# Altium schematic sheet Gas_Sampler-5V_Buck.SchDoc: 5V Buck
size Tabloid; Organization: Sensible Robotics LLC; Address1: 120 E Church Ave Suite B; Address2: Ridgecrest CA, 93555; Revision: 0; SheetNumber: 4; SheetTotal: 12; ApprovedBy: Approved Name; Engineer: Mike Licitra; PageSetup: Record=PageOptions|CenterHorizontal=True|CenterVertical=True|PrintScale=0.98|XCorrection=1.00|YCorrection=1.00|PrintKind=0|BorderSize=5000000|LeftOffset=0|BottomOffset=0|Orientation=2|PaperLength=1000|PaperWidth=1000|Scale=100|PaperSource=15|PrintQuality=600|MediaType=1|DitherType=10|PaperKind=Tabloid|PrintScaleMode=1
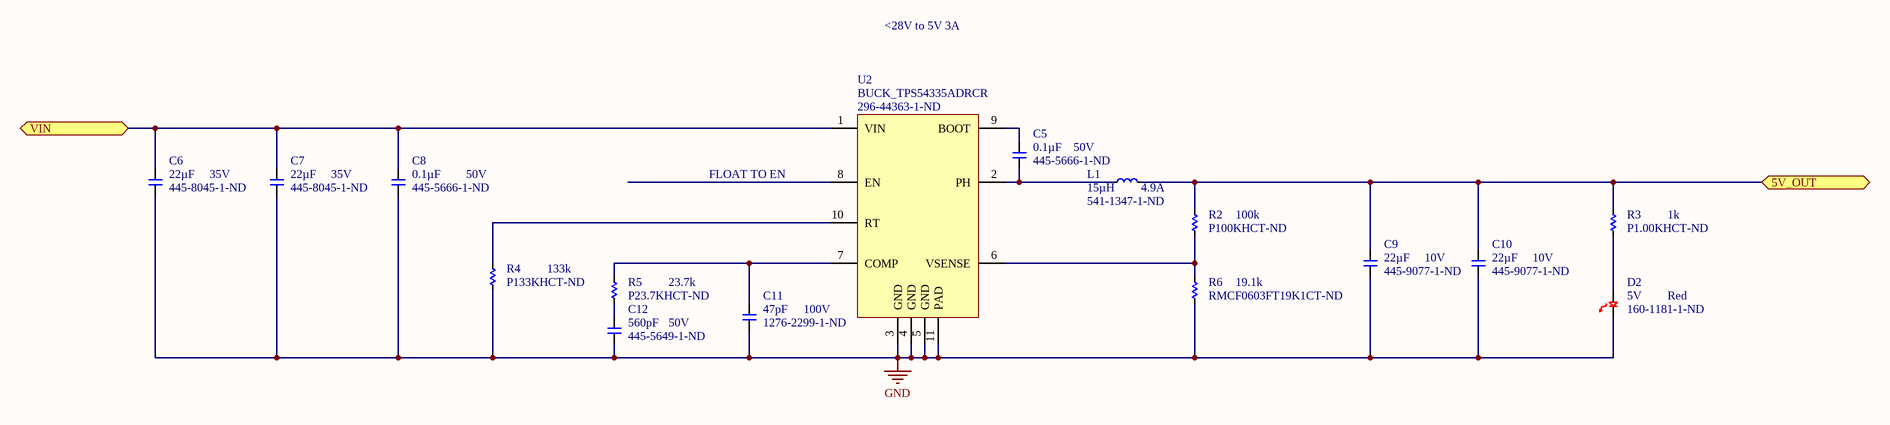
[diagram p0: Gas_Sampler-5V_Buck.SchDoc]

## Parts
C5  value 0.1µF  Voltage - Rated: 50V  Supplier Part Number 1: 445-5666-1-ND  [C0603]  (hidden comment: CAP_CER_0603_0.1UF_50V_10%_X7R)
C6  value 22µF  Voltage - Rated: 35V  Supplier Part Number 1: 445-8045-1-ND  [C1206]  (hidden comment: CAP_CER_1206_22UF_35V_20%_X5R)
C7  value 22µF  Voltage - Rated: 35V  Supplier Part Number 1: 445-8045-1-ND  [C1206]  (hidden comment: CAP_CER_1206_22UF_35V_20%_X5R)
C8  value 0.1µF  Voltage - Rated: 50V  Supplier Part Number 1: 445-5666-1-ND  [C0603]  (hidden comment: CAP_CER_0603_0.1UF_50V_10%_X7R)
C9  value 22µF  Supplier Part Number 1: 445-9077-1-ND  Voltage - Rated: 10V  [C0603]  (hidden comment: CAP_CER_0603_22UF_10V_20%_X5R)
C10  value 22µF  Supplier Part Number 1: 445-9077-1-ND  Voltage - Rated: 10V  [C0603]  (hidden comment: CAP_CER_0603_22UF_10V_20%_X5R)
C11  value 47pF  Voltage - Rated: 100V  Supplier Part Number 1: 1276-2299-1-ND  [C0603]  (hidden comment: CAP_CER_0603_47PF_100V_5%_NP0)
C12  value 560pF  Supplier Part Number 1: 445-5649-1-ND  Voltage - Rated: 50V  [C0603]  (hidden comment: CAP_CER_0603_560PF_50V_5%_NP0)
D2  5V  Supplier Part Number 1: 160-1181-1-ND  Color: Red  [LED_0603_RED]
L1  value 15µH  Current Rating: 4.9A  Supplier Part Number 1: 541-1347-1-ND  [INDUCTOR_IHLP3232_4MM_HEIGHT]  (hidden comment: IND_15UH_4.9A_IHLP3232DZER150M11)
R2  value 100k  Supplier Part Number 1: P100KHCT-ND  [R0603]  (hidden comment: RES_0603_100K_OHM_1/10W_1%)
R3  value 1k  Supplier Part Number 1: P1.00KHCT-ND  [R0603]  (hidden comment: RES_0603_1K_OHM_1/10W_1%)
R4  value 133k  Supplier Part Number 1: P133KHCT-ND  [R0603]  (hidden comment: RES_0603_133K_OHM_1/10W_1%)
R5  value 23.7k  Supplier Part Number 1: P23.7KHCT-ND  [R0603]  (hidden comment: RES_0603_23.7K_OHMS_1/10W_1%)
R6  value 19.1k  Supplier Part Number 1: RMCF0603FT19K1CT-ND  [R0603]  (hidden comment: RES_0603_19.1K_OHM_1/10W_1%)
U2  BUCK_TPS54335ADRCR  Supplier Part Number 1: 296-44363-1-ND  [PVSON50P300X300X70-10N]

## Ports
5V_OUT, VIN

## Nets
GND: C6.2 C7.2 C8.2 C9.2 C10.2 C11.2 C12.2 D2.2(CATHODE) R4.1 R6.1 U2.3(GND) U2.4(GND) U2.5(GND) U2.11(PAD)
5V_OUT: C9.1 C10.1 L1.2 R2.2 R3.2 ; port 5V_OUT
VIN: C6.1 C7.1 C8.1 U2.1(VIN) ; port VIN
NetC5_1: C5.1 U2.9(BOOT)
NetC5_2: C5.2 L1.1 U2.2(PH)
NetC11_1: C11.1 R5.2 U2.7(COMP)
NetC12_1: C12.1 R5.1
NetD2_1: D2.1(ANODE) R3.1
NetR2_1: R2.1 R6.2 U2.6(VSENSE)
NetR4_2: R4.2 U2.10(RT)

Not connected (* = marked no-connect by the designer): U2 8(EN)

## Notes on the sheet
- <28V to 5V 3A
- FLOAT TO EN
- CONFIDENTIAL DOCUMENT
- DUPLICATION PROHIBITED
- ENGINEER
- PCB FAB #
- SCH #
- REV
- Sensible
- Robotics
- THIS DOCUMENT CONTAINS INFORMATION AND OR DATA, WHICH IS PROPRIETARY AND CONFIDENTIAL TO SENSIBLE ROBOTICS LLC.  THIS INFORMATION AND OR DATA, IS TO BE USED ONLY FOR THE BENEFIT OF THE SUPPLIER, AND IS NOT TO BE USED FOR THE BENEFIT OF OTHER PARTIES WITHOUT WRITTEN CONSENT.
- DATE
- PCB ASSY #
- SIZE
- Tabloid
- SHEET
- OF
- FILE

## Library data of the parts
C5 C8 = CAP_CER_0603_0.1UF_50V_10%_X7R: CAP CER 0.1UF 50V 10% X7R 0603; Manufacturer: TDK Corporation; Manufacturer Part Number: CGA3E2X7R1H104K080AA; Supplier 1: Digi-Key; RoHS: RoHS Compliant; Packaging: Cut Tape (CT); Tolerance: ±10%; Temperature Coefficient: X7R; Mounting Type: Surface Mount, MLCC; Operating Temperature: -55°C ~ 125°C; Applications: Automotive; Ratings: AEC-Q200; Package / Case: 0603 (1608 Metric); Size / Dimension: 0.063" L x 0.031" W (1.60mm x 0.80mm); Thickness (Max): 0.035" (0.90mm); ComponentLink1URL: http://product.tdk.com/capacitor/mlcc/en/documents/mlcc_automotive_general_en.pdf; ComponentLink1Description: http://product.tdk.com/capacitor/mlcc/en/documents/mlcc_automotive_general_en.pdf
C6 C7 = CAP_CER_1206_22UF_35V_20%_X5R: CAP CER 22UF 35V X5R 1206; Manufacturer: TDK Corporation; Manufacturer Part Number: C3216X5R1V226M160AC; Tolerance: ±20%; Supplier 1: Digi-Key; RoHS: RoHS Compliant; Packaging: Cut Tape (CT); Temperature Coefficient: X5R; Mounting Type: Surface Mount, MLCC; Operating Temperature: -55°C ~ 85°C; Applications: General Purpose; Package / Case: 1206 (3216 Metric); Size / Dimension: 0.126" L x 0.063" W (3.20mm x 1.60mm); Thickness (Max): 0.071" (1.80mm); Features: Low ESL; ComponentLink1URL: https://product.tdk.com/info/en/catalog/datasheets/mlcc_commercial_general_en.pdf; ComponentLink1Description: https://product.tdk.com/info/en/catalog/datasheets/mlcc_commercial_general_en.pdf
C9 C10 = CAP_CER_0603_22UF_10V_20%_X5R: CAP CER 22UF 10V 20% X5R 0603; Manufacturer: TDK Corporation; Manufacturer Part Number: C1608X5R1A226M080AC; Part Number: 150-00202-00; Supplier 1: Digi-Key; Temperature Coefficient: X5R; Tolerance: ±20%
C11 = CAP_CER_0603_47PF_100V_5%_NP0: CAP CER 47PF 100V C0G/NP0 0603; Manufacturer: Samsung Electro-Mechanics; Manufacturer Part Number: CL10C470JC8NNNC; Tolerance: ±5%; Temperature Coefficient: C0G, NP0; Supplier 1: Digi-Key; RoHS: RoHS Compliant; Packaging: Cut Tape (CT); Mounting Type: Surface Mount, MLCC; Operating Temperature: -55°C ~ 125°C; Applications: General Purpose; Package / Case: 0603 (1608 Metric); Size / Dimension: 0.063" L x 0.031" W (1.60mm x 0.80mm); Thickness (Max): 0.035" (0.90mm); ComponentLink1URL: http://www.samsungsem.com/kr/support/product-search/mlcc/CL10C470JC8NNNC.jsp; ComponentLink1Description: Datasheet
C12 = CAP_CER_0603_560PF_50V_5%_NP0: CAP CER 560PF 50V 5% NP0 0603; Manufacturer: TDK Corporation; Manufacturer Part Number: CGA3E2C0G1H561J080AA; Temperature Coefficient: C0G, NP0; Supplier 1: Digi-Key; RoHS: RoHS Compliant; Packaging: Cut Tape (CT); Tolerance: ±5%; Mounting Type: Surface Mount, MLCC; Operating Temperature: -55°C ~ 125°C; Applications: Automotive; Ratings: AEC-Q200; Package / Case: 0603 (1608 Metric); Size / Dimension: 0.063" L x 0.031" W (1.60mm x 0.80mm); Thickness (Max): 0.035" (0.90mm); ComponentLink1URL: http://product.tdk.com/capacitor/mlcc/en/documents/mlcc_automotive_general_en.pdf; ComponentLink1Description: http://product.tdk.com/capacitor/mlcc/en/documents/mlcc_automotive_general_en.pdf
D2 = LED_0603_RED_LR_LTST-C190CKT: LED RED CLEAR 0603 SMD; Manufacturer: Lite-On Inc; Millicandela Rating: 10mcd; Wavelength - Dominant: 638nm; Wavelength - Peak: 660nm; Viewing Angle: 130°; Lens Style/Size: Rectangle with Flat Top, 1.1mm x 0.8mm; Voltage - Forward (Vf) Typ: 1.8V; Current - Test: 10mA; Supplier 1: Digi-Key; Manufacturer Part Number: LTST-C190CKT; Lens Type: Clear; Package / Case: 0603 (1608 Metric); Size / Dimension: 1.60mm L x 0.80mm W; Height: 0.80mm; Mounting Type: Surface Mount; Packaging: Cut Tape (CT); ComponentLink1URL: http://media.digikey.com/pdf/Data%20Sheets/Lite-On%20PDFs/LTST-C190CKT.pdf; ComponentLink1Description: Datasheet
L1 = IND_15UH_4.9A_IHLP3232DZER150M11: INDUCTOR POWER 15UH 4.9A SMD; Manufacturer: Vishay Dale; Tolerance: ±20%; Current - Saturation: 3.7A; Shielding: Shielded; DC Resistance (DCR): 65.3 mOhm Max; Frequency - Test: 100kHz; Supplier 1: Digi-Key; Manufacturer Part Number: IHLP3232DZER150M11; RoHS: RoHS Compliant; Category: Inductors, Coils, Chokes; Packaging: Cut Tape (CT); Operating Temperature: -55°C ~ 125°C; Mounting Type: Surface Mount; Package / Case: Non Standard; Size / Dimension: 0.340" L x 0.322" W (8.64mm x 8.18mm); Height - Seated (Max): 0.158" (4.00mm); ComponentLink1URL: http://media.digikey.com/PDF/Data%20Sheets/Vishay%20Dale%20PDFs/IHLP-3232DZ-11.pdf; ComponentLink1Description: http://media.digikey.com/PDF/Data%20Sheets/Vishay%20Dale%20PDFs/IHLP-3232DZ-11.pdf
R2 = RES_0603_100K_OHM_1/10W_1%: RES 100K OHM 1/10W 1% 0603 SMD; Manufacturer: Panasonic Electronic Components; Manufacturer Part Number: ERJ-3EKF1003V; Part Number: 470-00120-00; Power (Watts): 0.1W, 1/10W; Temperature Coefficient: ±100ppm/°C; Supplier 1: Digi-Key; RoHS: RoHS Compliant; Category: Resistors; Stock 1: 8082554; Pricing 1: 1=0.1, 50=0.0138, 100=0.0105, 250=0.0078, 500=0.00576, 1000=0.00384 (USD); Packaging: Cut Tape (CT); Composition: Thick Film; Features: -; Tolerance: ±1%; Package / Case: 0603 (1608 Metric); Supplier Device Package: 0603; Size / Dimension: 0.063" L x 0.031" W (1.60mm x 0.80mm); Height: 0.022" (0.55mm); Number of Terminations: 2; ComponentLink1URL: http://industrial.panasonic.com/www-cgi/jvcr13pz.cgi?E+PZ+3+AOA0002+ERJ3EKF1003V+7+WW; ComponentLink1Description: http://industrial.panasonic.com/www-cgi/jvcr13pz.cgi?E+PZ+3+AOA0002+ERJ3EKF1003V+7+WW
R3 = RES_0603_1K_OHM_1/10W_1%: RES 1K OHM 1/10W 1% 0603 SMD; Manufacturer: Panasonic Electronic Components; Manufacturer Part Number: ERJ-3EKF1001V; Power (Watts): 0.1W, 1/10W; Temperature Coefficient: ±100ppm/°C; Supplier 1: Digi-Key; RoHS: RoHS Compliant; Packaging: Cut Tape (CT); Composition: Thick Film; Features: -; Tolerance: ±1%; Package / Case: 0603 (1608 Metric); Supplier Device Package: 0603; Size / Dimension: 0.063" L x 0.031" W (1.60mm x 0.80mm); Height: 0.022" (0.55mm); Number of Terminations: 2; ComponentLink1URL: http://industrial.panasonic.com/www-cgi/jvcr13pz.cgi?E+PZ+3+AOA0002+ERJ3EKF1001V+7+WW; ComponentLink1Description: http://industrial.panasonic.com/www-cgi/jvcr13pz.cgi?E+PZ+3+AOA0002+ERJ3EKF1001V+7+WW
R4 = RES_0603_133K_OHM_1/10W_1%: RES 133K OHM 1% 1/10W 0603; Manufacturer: Panasonic Electronic Components; Manufacturer Part Number: ERJ-3EKF1333V; Power (Watts): 0.1W, 1/10W; Temperature Coefficient: ±100ppm/°C; Supplier 1: Digi-Key; Packaging: Cut Tape (CT); Tolerance: ±1%; Composition: Thick Film; Features: Automotive AEC-Q200; Operating Temperature: -55°C ~ 155°C; Package / Case: 0603 (1608 Metric); Supplier Device Package: 0603; Height: 0.022" (0.55mm); Number of Terminations: 2; ComponentLink1URL: http://industrial.panasonic.com/www-cgi/jvcr13pz.cgi?E+PZ+3+AOA0002+ERJ3EKF1183V+7+WW; ComponentLink1Description: http://industrial.panasonic.com/www-cgi/jvcr13pz.cgi?E+PZ+3+AOA0002+ERJ3EKF1183V+7+WW
R5 = RES_0603_23.7K_OHMS_1/10W_1%: RES 23.7K OHM 1% 1/10W 0603; Manufacturer: Panasonic Electronic Components; Manufacturer Part Number: ERJ-3EKF2372V; Power (Watts): 0.1W, 1/10W; Temperature Coefficient: ±100ppm/°C; Supplier 1: Digi-Key; RoHS: RoHS Compliant; Category: Resistors; Stock 1: 58901; Pricing 1: 1=0.1, 10=0.063, 100=0.0257, 1000=0.01153, 2500=0.01001 (USD); Packaging: Cut Tape (CT); Part Status: Active; Tolerance: ±1%; Composition: Thick Film; Features: Automotive AEC-Q200; Operating Temperature: -55°C ~ 155°C; Package / Case: 0603 (1608 Metric); Supplier Device Package: 0603; Size / Dimension: 0.063" L x 0.032" W (1.60mm x 0.80mm); Height - Seated (Max): 0.022" (0.55mm); ComponentLink1URL: https://industrial.panasonic.com/cdbs/www-data/pdf/RDA0000/AOA0000C304.pdf; ComponentLink1Description: https://industrial.panasonic.com/cdbs/www-data/pdf/RDA0000/AOA0000C304.pdf
R6 = RES_0603_19.1K_OHM_1/10W_1%: RES 19.1K OHM 1% 1/10W 0603; Manufacturer: Stackpole Electronics Inc; Manufacturer Part Number: RMCF0603FT19K1; Power (Watts): 0.1W, 1/10W; Temperature Coefficient: ±100ppm/°C; Supplier 1: Digi-Key; Packaging: Cut Tape (CT); Tolerance: ±1%; Composition: Thick Film; Features: Moisture Resistant; Operating Temperature: -55°C ~ 155°C; Package / Case: 0603 (1608 Metric); Supplier Device Package: 0603; Height: 0.022" (0.55mm); Number of Terminations: 2; ComponentLink1URL: https://www.seielect.com/catalog/sei-rmcf_rmcp.pdf; ComponentLink1Description: https://www.seielect.com/catalog/sei-rmcf_rmcp.pdf
U2 = BUCK_TPS54335ADRCR: IC REG BUCK ADJUSTABLE 3A 10VSON; Manufacturer: Texas Instruments; Function: Step-Down; Output Configuration: Positive; Number of Outputs: 1; Voltage - Input (Min): 4.5V; Voltage - Input (Max): 28V; Voltage - Output (Min/Fixed): 0.8V; Voltage - Output (Max): 24V; Frequency - Switching: 50kHz ~ 1.5MHz; Synchronous Rectifier: Yes; Supplier 1: Digi-Key; Manufacturer Part Number: TPS54335ADRCR; Packaging: Cut Tape (CT); Topology: Buck; Output Type: Adjustable; Current - Output: 3A; Operating Temperature: -40°C ~ 85°C (TA); Mounting Type: Surface Mount; Package / Case: 10-VFDFN Exposed Pad; Supplier Device Package: 10-VSON (3x3); ComponentLink1URL: http://www.ti.com/general/docs/suppproductinfo.tsp?distId=10&gotoUrl=http%3A%2F%2Fwww.ti.com%2Flit%2Fgpn%2Ftps54335a; ComponentLink1Description: http://www.ti.com/general/docs/suppproductinfo.tsp?distId=10&gotoUrl=http%3A%2F%2Fwww.ti.com%2Flit%2Fgpn%2Ftps54335a